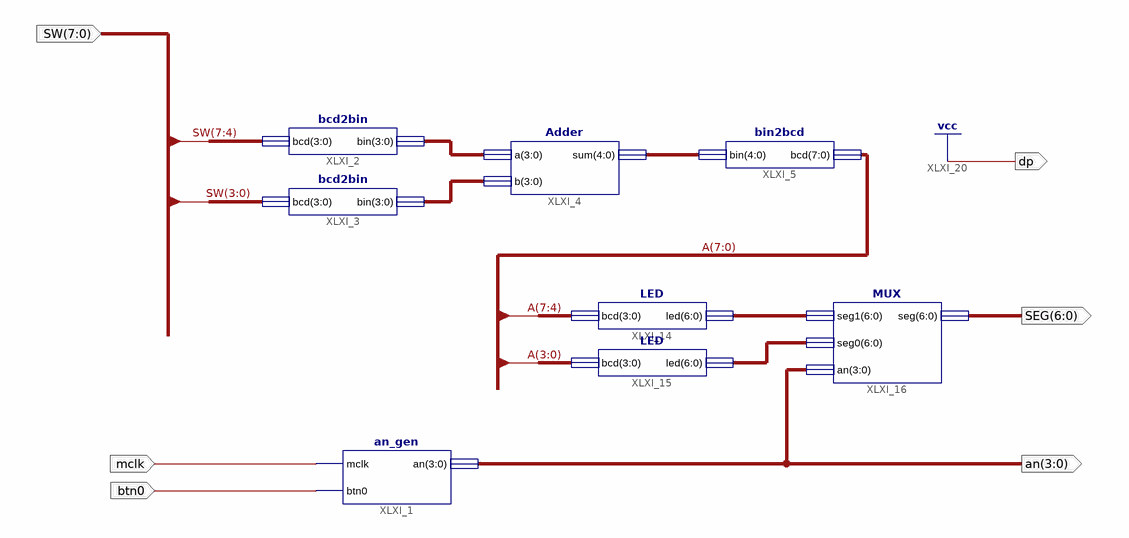
[diagram p0: schematic sheet 1]
// Xilinx ISE schematic lab2.sch (spartan3e) as structural Verilog: 8 symbols, 6 ports
module lab2 (
  input  mclk,
  input  btn0,
  input  [7:0] SW,
  output dp,
  output [3:0] an,
  output [6:0] SEG
);

  wire [3:0] XLXN_17, XLXN_18;
  wire [4:0] XLXN_19;
  wire [6:0] XLXN_29, XLXN_30;
  wire [7:0] A;

  an_gen XLXI_1 (.mclk(mclk), .btn0(btn0), .an(an));
  bcd2bin XLXI_2 (.bcd(SW[7:4]), .bin(XLXN_18));
  bcd2bin XLXI_3 (.bcd(SW[3:0]), .bin(XLXN_17));
  Adder XLXI_4 (.a(XLXN_18), .b(XLXN_17), .sum(XLXN_19));
  bin2bcd XLXI_5 (.bin(XLXN_19), .bcd(A));
  LED XLXI_14 (.bcd(A[7:4]), .led(XLXN_29));
  LED XLXI_15 (.bcd(A[3:0]), .led(XLXN_30));
  MUX XLXI_16 (.seg1(XLXN_29), .seg0(XLXN_30), .an(an), .seg(SEG));

  assign dp = 1'b1;
endmodule
